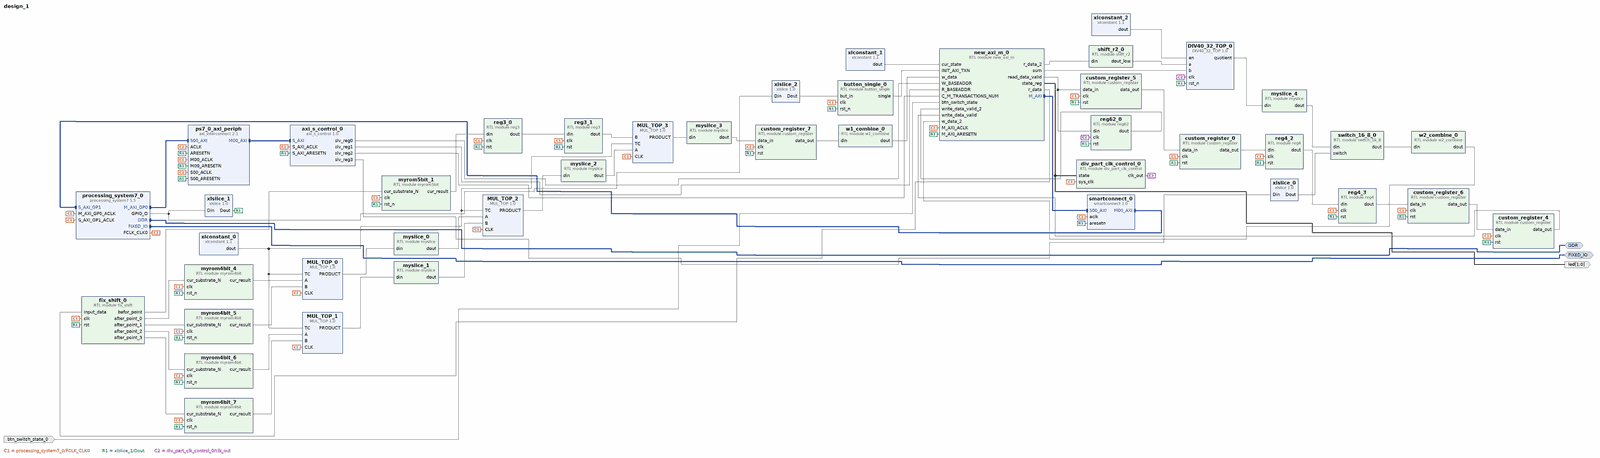
[diagram p0: block diagram of the top level, whole]
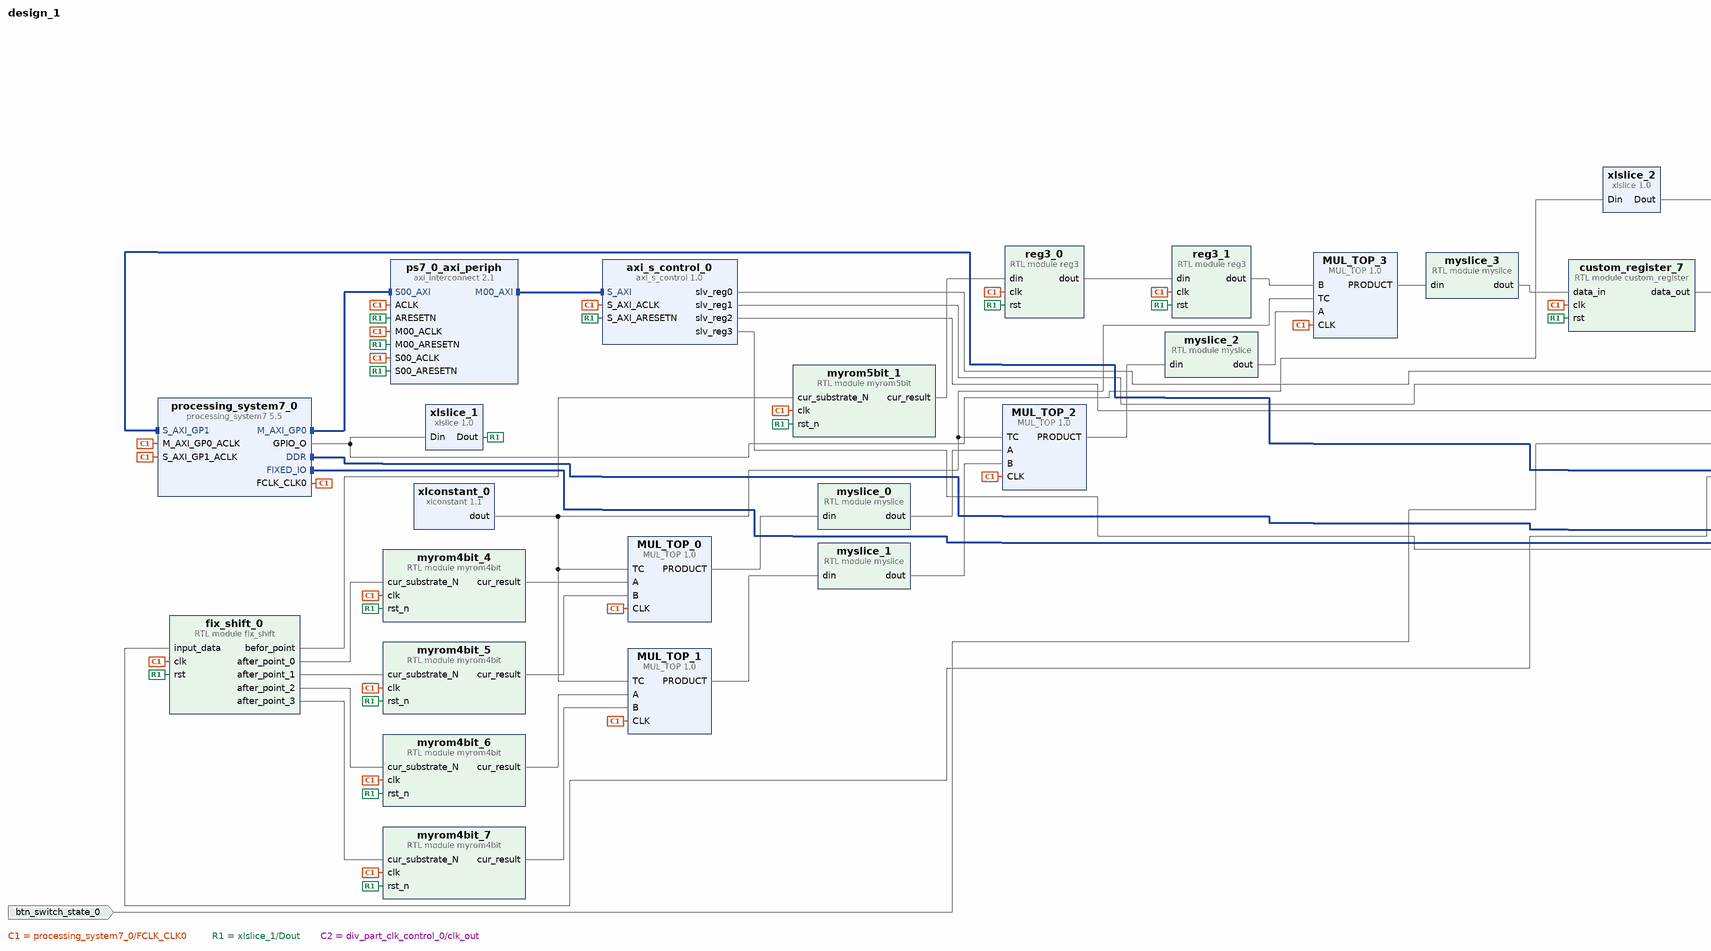
[diagram p1: block diagram of the top level, left part]
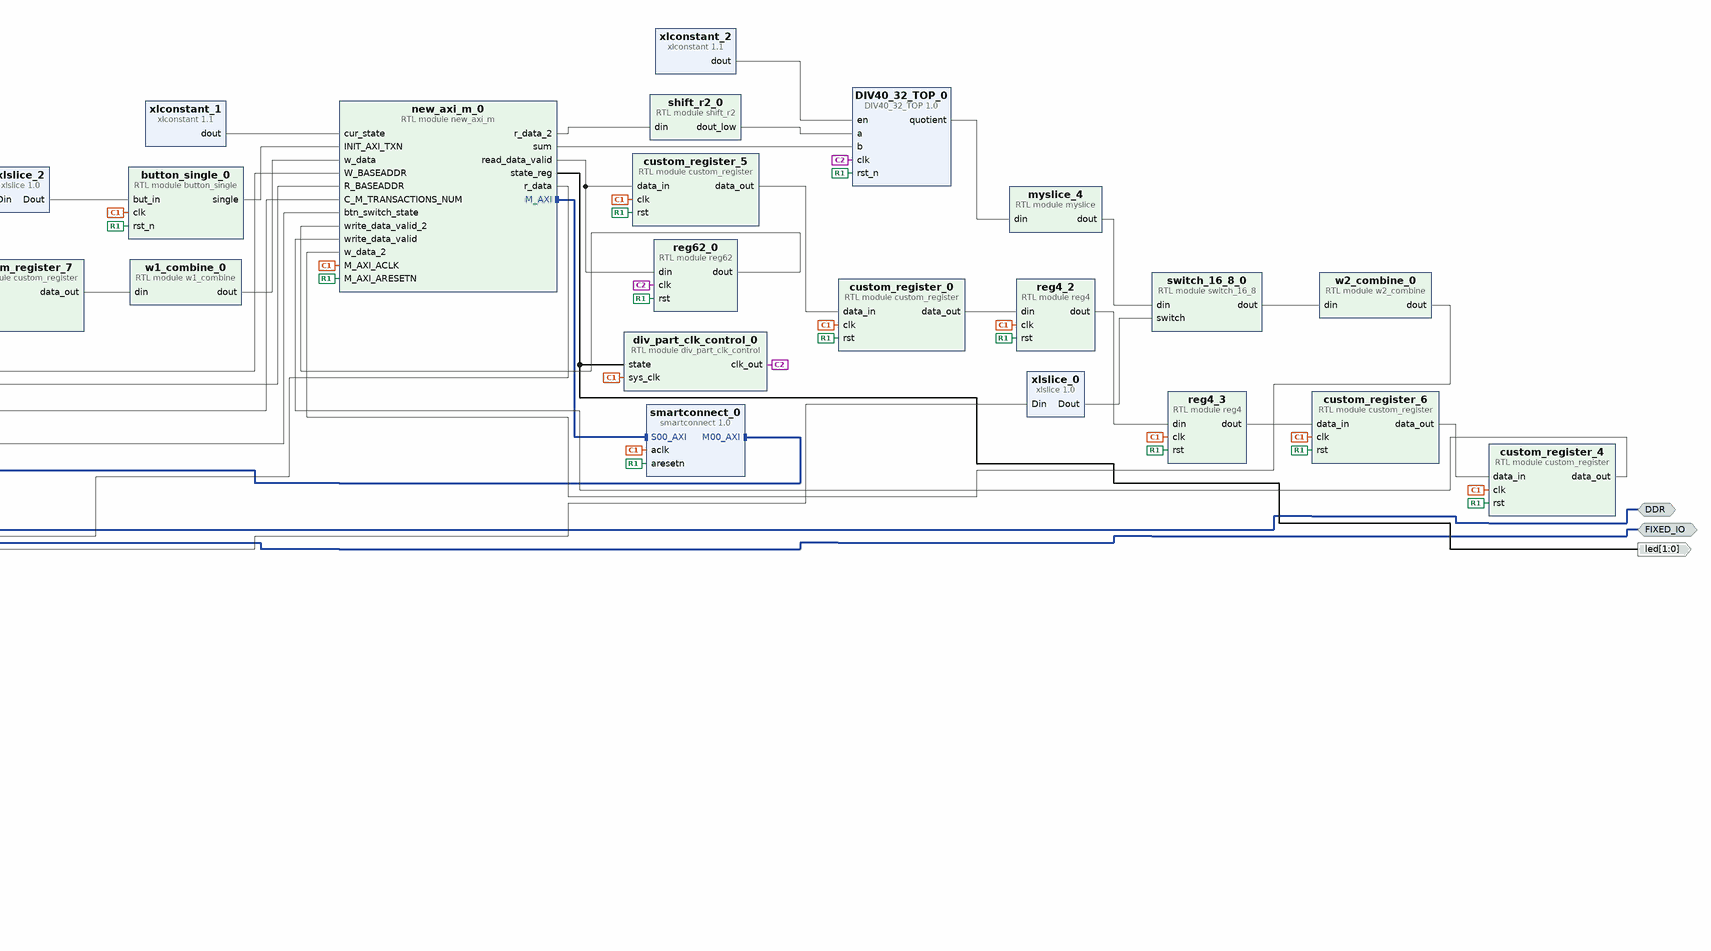
[diagram p2: block diagram of the top level, right part]
# Vivado block design design_1, xc7z020clg400-1, Vivado 2017.4
create_bd_design design_1

create_bd_intf_port -mode Master -vlnv xilinx.com:interface:ddrx_rtl:1.0 DDR
create_bd_intf_port -mode Master -vlnv xilinx.com:display_processing_system7:fixedio_rtl:1.0 FIXED_IO
create_bd_port -dir I btn_switch_state_0
create_bd_port -dir O -from 1 -to 0 led

create_bd_cell -type module -reference custom_register custom_register_0
set_property -dict {CONFIG.bits 0} [get_bd_cells custom_register_0]
create_bd_cell -type module -reference custom_register custom_register_4
set_property -dict {CONFIG.bits 0} [get_bd_cells custom_register_4]
create_bd_cell -type module -reference custom_register custom_register_5
set_property -dict {CONFIG.bits 0} [get_bd_cells custom_register_5]
create_bd_cell -type module -reference myslice myslice_0
set_property -dict [list \
  CONFIG.IN_BITS 31 \
  CONFIG.OUT_BITS 15 \
  CONFIG.SLICE_BIT_HIGH 30 \
  CONFIG.SLICE_BIT_LOW 15 \
] [get_bd_cells myslice_0]
create_bd_cell -type module -reference myslice myslice_1
set_property -dict [list \
  CONFIG.IN_BITS 31 \
  CONFIG.OUT_BITS 15 \
  CONFIG.SLICE_BIT_HIGH 30 \
  CONFIG.SLICE_BIT_LOW 15 \
] [get_bd_cells myslice_1]
create_bd_cell -type module -reference myslice myslice_2
set_property -dict [list \
  CONFIG.IN_BITS 31 \
  CONFIG.OUT_BITS 15 \
  CONFIG.SLICE_BIT_HIGH 30 \
  CONFIG.SLICE_BIT_LOW 15 \
] [get_bd_cells myslice_2]
create_bd_cell -type module -reference button_single button_single_0
create_bd_cell -type module -reference div_part_clk_control div_part_clk_control_0
create_bd_cell -type module -reference myrom4bit myrom4bit_4
set_property -dict [list \
  CONFIG.RESULT_00 0x8000 \
  CONFIG.RESULT_01 0x783E \
  CONFIG.RESULT_02 0x70F5 \
  CONFIG.RESULT_03 0x6A1D \
  CONFIG.RESULT_04 0x63AF \
  CONFIG.RESULT_05 0x5DA5 \
  CONFIG.RESULT_06 0x57F9 \
  CONFIG.RESULT_07 0x52A4 \
  CONFIG.RESULT_08 0x4DA2 \
  CONFIG.RESULT_09 0x48EE \
  CONFIG.RESULT_10 0x4483 \
  CONFIG.RESULT_11 0x405C \
  CONFIG.RESULT_12 0x3C76 \
  CONFIG.RESULT_13 0x38CC \
  CONFIG.RESULT_14 0x355B \
  CONFIG.RESULT_15 0x3220 \
] [get_bd_cells myrom4bit_4]
create_bd_cell -type module -reference myrom4bit myrom4bit_5
set_property -dict [list \
  CONFIG.RESULT_00 0x8000 \
  CONFIG.RESULT_01 0x7F80 \
  CONFIG.RESULT_02 0x7F00 \
  CONFIG.RESULT_03 0x7E82 \
  CONFIG.RESULT_04 0x7E03 \
  CONFIG.RESULT_05 0x7D86 \
  CONFIG.RESULT_06 0x7D08 \
  CONFIG.RESULT_07 0x7C8C \
  CONFIG.RESULT_08 0x7C0F \
  CONFIG.RESULT_09 0x7B94 \
  CONFIG.RESULT_10 0x7B18 \
  CONFIG.RESULT_11 0x7A9D \
  CONFIG.RESULT_12 0x7A23 \
  CONFIG.RESULT_13 0x79A9 \
  CONFIG.RESULT_14 0x7930 \
  CONFIG.RESULT_15 0x78B7 \
] [get_bd_cells myrom4bit_5]
create_bd_cell -type module -reference myrom4bit myrom4bit_6
set_property -dict [list \
  CONFIG.RESULT_00 0x8000 \
  CONFIG.RESULT_01 0x7FF8 \
  CONFIG.RESULT_02 0x7FF0 \
  CONFIG.RESULT_03 0x7FE8 \
  CONFIG.RESULT_04 0x7FE0 \
  CONFIG.RESULT_05 0x7FD8 \
  CONFIG.RESULT_06 0x7FD0 \
  CONFIG.RESULT_07 0x7FC8 \
  CONFIG.RESULT_08 0x7FC0 \
  CONFIG.RESULT_09 0x7FB8 \
  CONFIG.RESULT_10 0x7FB0 \
  CONFIG.RESULT_11 0x7FA8 \
  CONFIG.RESULT_12 0x7FA0 \
  CONFIG.RESULT_13 0x7F98 \
  CONFIG.RESULT_14 0x7F90 \
  CONFIG.RESULT_15 0x7F88 \
] [get_bd_cells myrom4bit_6]
create_bd_cell -type module -reference myrom4bit myrom4bit_7
set_property -dict [list \
  CONFIG.RESULT_00 0x8000 \
  CONFIG.RESULT_01 0x0000 \
  CONFIG.RESULT_02 0x7FFF \
  CONFIG.RESULT_03 0x7FFE \
  CONFIG.RESULT_04 0x7FFE \
  CONFIG.RESULT_05 0x7FFD \
  CONFIG.RESULT_06 0x7FFD \
  CONFIG.RESULT_07 0x7FFC \
  CONFIG.RESULT_08 0x7FFC \
  CONFIG.RESULT_09 0x7FFB \
  CONFIG.RESULT_10 0x7FFB \
  CONFIG.RESULT_11 0x7FFA \
  CONFIG.RESULT_12 0x7FFA \
  CONFIG.RESULT_13 0x7FF9 \
  CONFIG.RESULT_14 0x7FF9 \
  CONFIG.RESULT_15 0x7FF8 \
] [get_bd_cells myrom4bit_7]
create_bd_cell -type module -reference myrom5bit myrom5bit_1
set_property -dict [list \
  CONFIG.RESULT_00 0x8000 \
  CONFIG.RESULT_01 0x2F16 \
  CONFIG.RESULT_02 0x1152 \
  CONFIG.RESULT_03 0x065F \
  CONFIG.RESULT_04 0x0258 \
  CONFIG.RESULT_05 0x00DC \
  CONFIG.RESULT_06 0x0051 \
  CONFIG.RESULT_07 0x001D \
  CONFIG.RESULT_08 0x000A \
  CONFIG.RESULT_09 0x0004 \
  CONFIG.RESULT_10 0x0001 \
  CONFIG.RESULT_11 0x0000 \
  CONFIG.RESULT_12 0x0000 \
  CONFIG.RESULT_13 0x0000 \
  CONFIG.RESULT_14 0x0000 \
  CONFIG.RESULT_15 0x0000 \
  CONFIG.RESULT_16 0x0000 \
  CONFIG.RESULT_17 0x0000 \
  CONFIG.RESULT_18 0x0000 \
  CONFIG.RESULT_19 0x0000 \
  CONFIG.RESULT_20 0x0000 \
  CONFIG.RESULT_21 0x0000 \
  CONFIG.RESULT_22 0x0000 \
  CONFIG.RESULT_23 0x0000 \
  CONFIG.RESULT_24 0x0000 \
  CONFIG.RESULT_25 0x0000 \
  CONFIG.RESULT_26 0x0000 \
  CONFIG.RESULT_27 0x0000 \
  CONFIG.RESULT_28 0x0000 \
  CONFIG.RESULT_29 0x0000 \
  CONFIG.RESULT_30 0x0000 \
  CONFIG.RESULT_31 0x0000 \
] [get_bd_cells myrom5bit_1]
create_bd_cell -type module -reference reg4 reg4_2
set_property -dict {CONFIG.BITS 0} [get_bd_cells reg4_2]
create_bd_cell -type module -reference reg4 reg4_3
set_property -dict {CONFIG.BITS 0} [get_bd_cells reg4_3]
create_bd_cell -type module -reference custom_register custom_register_6
set_property -dict {CONFIG.bits 0} [get_bd_cells custom_register_6]
create_bd_cell -type module -reference myslice myslice_3
set_property -dict [list \
  CONFIG.IN_BITS 31 \
  CONFIG.OUT_BITS 15 \
  CONFIG.SLICE_BIT_HIGH 30 \
  CONFIG.SLICE_BIT_LOW 15 \
] [get_bd_cells myslice_3]
create_bd_cell -type module -reference w1_combine w1_combine_0
create_bd_cell -type module -reference custom_register custom_register_7
set_property -dict {CONFIG.bits 15} [get_bd_cells custom_register_7]
create_bd_cell -type module -reference reg62 reg62_0
set_property -dict {CONFIG.BITS 0} [get_bd_cells reg62_0]
create_bd_cell -type module -reference myslice myslice_4
set_property -dict {CONFIG.IN_BITS 39 CONFIG.OUT_BITS 31 CONFIG.SLICE_BIT_HIGH 31 CONFIG.SLICE_BIT_LOW 0} [get_bd_cells myslice_4]
create_bd_cell -type module -reference reg3 reg3_0
set_property -dict {CONFIG.BITS 15} [get_bd_cells reg3_0]
create_bd_cell -type module -reference reg3 reg3_1
set_property -dict {CONFIG.BITS 15} [get_bd_cells reg3_1]
create_bd_cell -type module -reference shift_r2 shift_r2_0
create_bd_cell -type module -reference w2_combine w2_combine_0
create_bd_cell -type module -reference switch_16_8 switch_16_8_0
create_bd_cell -type module -reference fix_shift fix_shift_0
create_bd_cell -type ip -vlnv xilinx.com:user:MUL_TOP:1.0 MUL_TOP_0
create_bd_cell -type ip -vlnv xilinx.com:user:MUL_TOP:1.0 MUL_TOP_1
create_bd_cell -type ip -vlnv xilinx.com:user:MUL_TOP:1.0 MUL_TOP_2
create_bd_cell -type ip -vlnv xilinx.com:user:MUL_TOP:1.0 MUL_TOP_3
create_bd_cell -type ip -vlnv xilinx.com:ip:axi_interconnect:2.1 ps7_0_axi_periph
set_property -dict {CONFIG.NUM_MI 1} [get_bd_cells ps7_0_axi_periph]
create_bd_cell -type ip -vlnv xilinx.com:ip:smartconnect:1.0 smartconnect_0
set_property -dict {CONFIG.NUM_SI 1} [get_bd_cells smartconnect_0]
create_bd_cell -type ip -vlnv xilinx.com:ip:xlconstant:1.1 xlconstant_0
set_property -dict {CONFIG.CONST_VAL 0} [get_bd_cells xlconstant_0]
create_bd_cell -type ip -vlnv xilinx.com:ip:xlconstant:1.1 xlconstant_1
set_property -dict {CONFIG.CONST_WIDTH 2 CONFIG.CONST_VAL 01} [get_bd_cells xlconstant_1]
create_bd_cell -type ip -vlnv xilinx.com:ip:xlconstant:1.1 xlconstant_2
create_bd_cell -type ip -vlnv xilinx.com:ip:processing_system7:5.5 processing_system7_0
set_property -dict [list \
  CONFIG.PCW_UIPARAM_DDR_FREQ_MHZ 525 \
  CONFIG.PCW_APU_PERIPHERAL_FREQMHZ 650 \
  CONFIG.PCW_FPGA0_PERIPHERAL_FREQMHZ 100 \
  CONFIG.PCW_USE_S_AXI_GP1 1 \
  CONFIG.PCW_GPIO_EMIO_GPIO_WIDTH 2 \
  CONFIG.PCW_UIPARAM_DDR_BUS_WIDTH {16 Bit} \
  CONFIG.PCW_UIPARAM_DDR_PARTNO {MT41J256M16 RE-125} \
  CONFIG.PCW_GPIO_MIO_GPIO_ENABLE 0 \
  CONFIG.PCW_GPIO_EMIO_GPIO_ENABLE 1 \
  CONFIG.PCW_GPIO_EMIO_GPIO_IO 2 \
] [get_bd_cells processing_system7_0]
# 37 more settings of processing_system7_0 are not shown: defaults, MIO pin electricals, DDR timing, and values the tool derives
create_bd_cell -type ip -vlnv xilinx.com:ip:xlslice:1.0 xlslice_0
create_bd_cell -type ip -vlnv xilinx.com:ip:xlslice:1.0 xlslice_1
set_property -dict {CONFIG.DIN_TO 0 CONFIG.DIN_FROM 0 CONFIG.DIN_WIDTH 2} [get_bd_cells xlslice_1]
create_bd_cell -type ip -vlnv xilinx.com:ip:xlslice:1.0 xlslice_2
set_property -dict {CONFIG.DIN_TO 1 CONFIG.DIN_FROM 1 CONFIG.DIN_WIDTH 2 CONFIG.DOUT_WIDTH 1} [get_bd_cells xlslice_2]
create_bd_cell -type ip -vlnv xilinx.com:user:axi_s_control:1.0 axi_s_control_0
create_bd_cell -type module -reference new_axi_m new_axi_m_0
set_property -dict {CONFIG.C_M_START_DATA_VALUE 0x00000000} [get_bd_cells new_axi_m_0]
create_bd_cell -type ip -vlnv xilinx.com:user:DIV40_32_TOP:1.0 DIV40_32_TOP_0

# ---- connections ----

connect_bd_intf_net [get_bd_intf_pins new_axi_m_0/M_AXI] [get_bd_intf_pins smartconnect_0/S00_AXI]
connect_bd_intf_net [get_bd_intf_pins processing_system7_0/M_AXI_GP0] [get_bd_intf_pins ps7_0_axi_periph/S00_AXI]
connect_bd_intf_net [get_bd_intf_pins axi_s_control_0/S_AXI] [get_bd_intf_pins ps7_0_axi_periph/M00_AXI]
connect_bd_intf_net [get_bd_intf_pins smartconnect_0/M00_AXI] [get_bd_intf_pins processing_system7_0/S_AXI_GP1]
connect_bd_intf_net [get_bd_intf_ports DDR] [get_bd_intf_pins processing_system7_0/DDR]
connect_bd_intf_net [get_bd_intf_ports FIXED_IO] [get_bd_intf_pins processing_system7_0/FIXED_IO]
connect_bd_net -net clk_0_1 [get_bd_pins processing_system7_0/FCLK_CLK0] \
  [get_bd_pins custom_register_0/clk] [get_bd_pins custom_register_4/clk] [get_bd_pins custom_register_5/clk] \
  [get_bd_pins button_single_0/clk] [get_bd_pins div_part_clk_control_0/sys_clk] [get_bd_pins myrom4bit_4/clk] \
  [get_bd_pins myrom4bit_5/clk] [get_bd_pins myrom4bit_6/clk] [get_bd_pins myrom4bit_7/clk] [get_bd_pins myrom5bit_1/clk] \
  [get_bd_pins reg4_2/clk] [get_bd_pins reg4_3/clk] [get_bd_pins custom_register_6/clk] [get_bd_pins custom_register_7/clk] \
  [get_bd_pins reg3_0/clk] [get_bd_pins reg3_1/clk] [get_bd_pins fix_shift_0/clk] [get_bd_pins MUL_TOP_0/CLK] \
  [get_bd_pins MUL_TOP_1/CLK] [get_bd_pins MUL_TOP_2/CLK] [get_bd_pins MUL_TOP_3/CLK] [get_bd_pins smartconnect_0/aclk] \
  [get_bd_pins processing_system7_0/M_AXI_GP0_ACLK] [get_bd_pins axi_s_control_0/S_AXI_ACLK] \
  [get_bd_pins processing_system7_0/S_AXI_GP1_ACLK] [get_bd_pins new_axi_m_0/M_AXI_ACLK] [get_bd_pins ps7_0_axi_periph/ACLK] \
  [get_bd_pins ps7_0_axi_periph/S00_ACLK] [get_bd_pins ps7_0_axi_periph/M00_ACLK]
connect_bd_net -net rst_ps7_0_100M_peripheral_aresetn [get_bd_pins xlslice_1/Dout] \
  [get_bd_pins custom_register_0/rst] [get_bd_pins custom_register_4/rst] [get_bd_pins custom_register_5/rst] \
  [get_bd_pins button_single_0/rst_n] [get_bd_pins myrom4bit_4/rst_n] [get_bd_pins myrom4bit_5/rst_n] \
  [get_bd_pins myrom4bit_6/rst_n] [get_bd_pins myrom4bit_7/rst_n] [get_bd_pins myrom5bit_1/rst_n] [get_bd_pins reg4_2/rst] \
  [get_bd_pins reg4_3/rst] [get_bd_pins custom_register_6/rst] [get_bd_pins custom_register_7/rst] [get_bd_pins reg62_0/rst] \
  [get_bd_pins reg3_0/rst] [get_bd_pins reg3_1/rst] [get_bd_pins fix_shift_0/rst] [get_bd_pins smartconnect_0/aresetn] \
  [get_bd_pins axi_s_control_0/S_AXI_ARESETN] [get_bd_pins new_axi_m_0/M_AXI_ARESETN] [get_bd_pins ps7_0_axi_periph/ARESETN] \
  [get_bd_pins ps7_0_axi_periph/S00_ARESETN] [get_bd_pins ps7_0_axi_periph/M00_ARESETN] [get_bd_pins DIV40_32_TOP_0/rst_n]
connect_bd_net [get_bd_pins new_axi_m_0/r_data] [get_bd_pins fix_shift_0/input_data]
connect_bd_net [get_bd_pins xlconstant_1/dout] [get_bd_pins new_axi_m_0/cur_state]
connect_bd_net [get_bd_pins fix_shift_0/after_point_0] [get_bd_pins myrom4bit_4/cur_substrate_N]
connect_bd_net [get_bd_pins fix_shift_0/after_point_1] [get_bd_pins myrom4bit_5/cur_substrate_N]
connect_bd_net [get_bd_pins fix_shift_0/after_point_2] [get_bd_pins myrom4bit_6/cur_substrate_N]
connect_bd_net [get_bd_pins fix_shift_0/after_point_3] [get_bd_pins myrom4bit_7/cur_substrate_N]
connect_bd_net [get_bd_pins fix_shift_0/befor_point] [get_bd_pins myrom5bit_1/cur_substrate_N]
connect_bd_net [get_bd_pins custom_register_5/data_out] [get_bd_pins custom_register_0/data_in]
connect_bd_net [get_bd_pins new_axi_m_0/read_data_valid] [get_bd_pins custom_register_5/data_in] [get_bd_pins reg62_0/din]
connect_bd_net [get_bd_pins custom_register_4/data_out] [get_bd_pins new_axi_m_0/write_data_valid]
connect_bd_net [get_bd_pins new_axi_m_0/sum] [get_bd_pins DIV40_32_TOP_0/b]
connect_bd_net [get_bd_pins new_axi_m_0/r_data_2] [get_bd_pins shift_r2_0/din]
connect_bd_net [get_bd_pins button_single_0/single] [get_bd_pins new_axi_m_0/INIT_AXI_TXN]
connect_bd_net [get_bd_pins div_part_clk_control_0/clk_out] [get_bd_pins reg62_0/clk] [get_bd_pins DIV40_32_TOP_0/clk]
connect_bd_net [get_bd_pins xlconstant_0/dout] \
  [get_bd_pins MUL_TOP_0/TC] [get_bd_pins MUL_TOP_1/TC] [get_bd_pins MUL_TOP_2/TC] [get_bd_pins MUL_TOP_3/TC]
connect_bd_net [get_bd_pins myrom5bit_1/cur_result] [get_bd_pins reg3_0/din]
connect_bd_net [get_bd_pins myslice_2/dout] [get_bd_pins MUL_TOP_3/A]
connect_bd_net [get_bd_pins custom_register_0/data_out] [get_bd_pins reg4_2/din]
connect_bd_net [get_bd_pins reg4_2/dout] [get_bd_pins reg4_3/din]
connect_bd_net [get_bd_pins reg4_3/dout] [get_bd_pins custom_register_6/data_in]
connect_bd_net [get_bd_pins myrom4bit_4/cur_result] [get_bd_pins MUL_TOP_0/A]
connect_bd_net [get_bd_pins myrom4bit_5/cur_result] [get_bd_pins MUL_TOP_0/B]
connect_bd_net [get_bd_pins MUL_TOP_0/PRODUCT] [get_bd_pins myslice_0/din]
connect_bd_net [get_bd_pins myrom4bit_6/cur_result] [get_bd_pins MUL_TOP_1/A]
connect_bd_net [get_bd_pins myrom4bit_7/cur_result] [get_bd_pins MUL_TOP_1/B]
connect_bd_net [get_bd_pins MUL_TOP_1/PRODUCT] [get_bd_pins myslice_1/din]
connect_bd_net [get_bd_pins myslice_0/dout] [get_bd_pins MUL_TOP_2/A]
connect_bd_net [get_bd_pins myslice_1/dout] [get_bd_pins MUL_TOP_2/B]
connect_bd_net [get_bd_pins MUL_TOP_2/PRODUCT] [get_bd_pins myslice_2/din]
connect_bd_net [get_bd_pins MUL_TOP_3/PRODUCT] [get_bd_pins myslice_3/din]
connect_bd_net -net btn_switch_state_0_1 [get_bd_ports btn_switch_state_0] [get_bd_pins new_axi_m_0/btn_switch_state]
connect_bd_net [get_bd_pins custom_register_6/data_out] [get_bd_pins custom_register_4/data_in]
connect_bd_net [get_bd_pins myslice_3/dout] [get_bd_pins custom_register_7/data_in]
connect_bd_net [get_bd_pins custom_register_7/data_out] [get_bd_pins w1_combine_0/din]
connect_bd_net [get_bd_pins w1_combine_0/dout] [get_bd_pins new_axi_m_0/w_data]
connect_bd_net [get_bd_pins reg62_0/dout] [get_bd_pins new_axi_m_0/write_data_valid_2]
connect_bd_net [get_bd_pins shift_r2_0/dout_low] [get_bd_pins DIV40_32_TOP_0/a]
connect_bd_net [get_bd_pins xlconstant_2/dout] [get_bd_pins DIV40_32_TOP_0/en]
connect_bd_net [get_bd_pins myslice_4/dout] [get_bd_pins switch_16_8_0/din]
connect_bd_net [get_bd_pins reg3_0/dout] [get_bd_pins reg3_1/din]
connect_bd_net [get_bd_pins reg3_1/dout] [get_bd_pins MUL_TOP_3/B]
connect_bd_net [get_bd_pins DIV40_32_TOP_0/quotient] [get_bd_pins myslice_4/din]
connect_bd_net [get_bd_pins w2_combine_0/dout] [get_bd_pins new_axi_m_0/w_data_2]
connect_bd_net [get_bd_pins switch_16_8_0/dout] [get_bd_pins w2_combine_0/din]
connect_bd_net [get_bd_pins new_axi_m_0/state_reg] [get_bd_ports led] [get_bd_pins div_part_clk_control_0/state]
connect_bd_net [get_bd_pins xlslice_0/Dout] [get_bd_pins switch_16_8_0/switch]
connect_bd_net [get_bd_pins processing_system7_0/GPIO_O] [get_bd_pins xlslice_1/Din] [get_bd_pins xlslice_2/Din]
connect_bd_net [get_bd_pins xlslice_2/Dout] [get_bd_pins button_single_0/but_in]
connect_bd_net [get_bd_pins axi_s_control_0/slv_reg0] [get_bd_pins new_axi_m_0/W_BASEADDR]
connect_bd_net [get_bd_pins axi_s_control_0/slv_reg1] [get_bd_pins new_axi_m_0/R_BASEADDR]
connect_bd_net [get_bd_pins axi_s_control_0/slv_reg2] [get_bd_pins new_axi_m_0/C_M_TRANSACTIONS_NUM]
connect_bd_net [get_bd_pins axi_s_control_0/slv_reg3] [get_bd_pins xlslice_0/Din]

# ---- address map ----
assign_bd_address -offset 0x00000000 -range 512M -target_address_space [get_bd_addr_spaces new_axi_m_0/M_AXI] [get_bd_addr_segs processing_system7_0/S_AXI_GP1/GP1_DDR_LOWOCM]
assign_bd_address -offset 0x40000000 -range 1G -target_address_space [get_bd_addr_spaces new_axi_m_0/M_AXI] [get_bd_addr_segs processing_system7_0/S_AXI_GP1/GP1_M_AXI_GP0]
assign_bd_address -offset 0x43C00000 -range 64K -target_address_space [get_bd_addr_spaces processing_system7_0/Data] [get_bd_addr_segs axi_s_control_0/S_AXI/reg0]

validate_bd_design
save_bd_design
